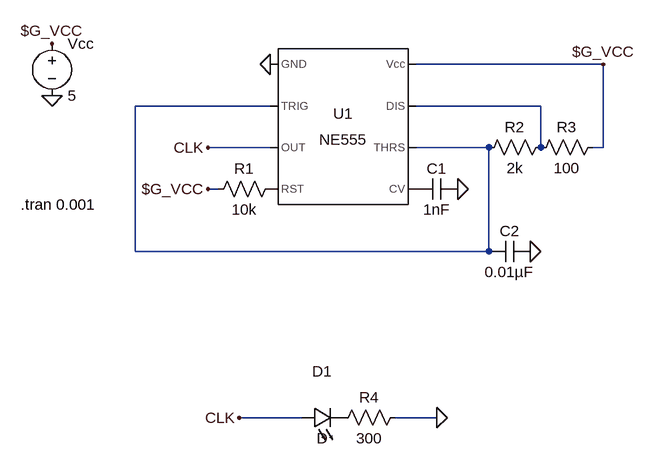
[diagram p0: schematic remote.asc]
remote.asc, the LTspice schematic file:
Version 4.1
SHEET 1 880 680
WIRE 400 -192 112 -192
WIRE -112 -128 -320 -128
WIRE 304 -128 112 -128
WIRE -112 -64 -208 -64
WIRE 224 -64 112 -64
WIRE 304 -64 304 -128
WIRE 400 -64 400 -192
WIRE 400 -64 384 -64
WIRE -192 0 -208 0
WIRE -320 96 -320 -128
WIRE 224 96 224 -64
WIRE 224 96 -320 96
WIRE -64 352 -160 352
WIRE 144 352 80 352
FLAG -112 -192 0
FLAG 176 0 0
FLAG -208 0 $G_VCC
FLAG -448 -144 0
FLAG 400 -192 $G_VCC
FLAG -208 -64 CLK
FLAG -160 352 CLK
FLAG 144 352 0
FLAG 288 96 0
FLAG -448 -224 $G_VCC
SYMBOL Misc\\NE555 0 -96 R0
SYMATTR InstName U1
SYMBOL cap 176 -16 R90
WINDOW 0 0 32 VBottom 2
WINDOW 3 32 32 VTop 2
SYMATTR InstName C1
SYMATTR Value 1nF
SYMBOL res -96 -16 R90
WINDOW 0 0 56 VBottom 2
WINDOW 3 32 56 VTop 2
SYMATTR InstName R1
SYMATTR Value 10k
SYMBOL voltage -448 -240 R0
WINDOW 123 0 0 Left 0
WINDOW 39 0 0 Left 0
SYMATTR InstName Vcc
SYMATTR Value 5
SYMBOL res 320 -80 R90
WINDOW 0 0 56 VBottom 2
WINDOW 3 32 56 VTop 2
SYMATTR InstName R2
SYMATTR Value 2k
SYMBOL res 400 -80 R90
WINDOW 0 0 56 VBottom 2
WINDOW 3 32 56 VTop 2
SYMATTR InstName R3
SYMATTR Value 100
SYMBOL LED -64 368 R270
WINDOW 0 72 32 VTop 2
WINDOW 3 0 32 VBottom 2
SYMATTR InstName D1
SYMBOL res 96 336 R90
WINDOW 0 0 56 VBottom 2
WINDOW 3 32 56 VTop 2
SYMATTR InstName R4
SYMATTR Value 300
SYMBOL cap 288 80 R90
WINDOW 0 0 32 VBottom 2
WINDOW 3 32 32 VTop 2
SYMATTR InstName C2
SYMATTR Value 0.01µF
TEXT -496 24 Left 2 !.tran 0.001

The netlist it stands for:
* remote.asc
X§U1 0 N001 CLK P001 P002 N001 N002 $G_VCC NE555  ; pins GND TRIG OUT RST CV THRS DIS Vcc
C1 0 P002 1nF
R1 P001 $G_VCC 10k
Vcc $G_VCC 0 5
R2 N002 N001 2k
R3 $G_VCC N002 100
D1 CLK P003 D
R4 0 P003 300
C2 0 N001 0.01µF
.model D D
.lib standard.dio
.tran 0.001
.lib NE555.sub
.backanno
.end